# EAGLE design OPTO (EAGLE 6.6.0)
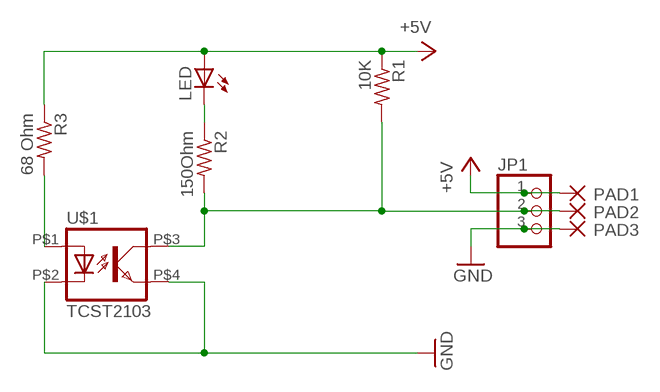
[diagram p0: schematic, sheet 1]

## Parts
JP1  PINHD-1X3CB  [1X03-CLEANBIG]
LED  LEDCHIPLED_0805  [CHIPLED_0805]
PAD1  WIREPADSMD1,27-254  [SMD1,27-2,54]
PAD2  WIREPADSMD1,27-254  [SMD1,27-2,54]
PAD3  WIREPADSMD1,27-254  [SMD1,27-2,54]
R1  10K  R-US_R0805  [R0805]
R2  150Ohm  R-US_R0805  [R0805]
R3  68 Ohm  R-US_R0805  [R0805]
U$1  TCST2103  [TCST2103]

## Nets
+5V: JP1.1 LED.A PAD1.1(P) R1.1 R3.1
GND: JP1.3 PAD3.1(P) U$1.P$2(C) U$1.P$4(EMIT)
N$1: LED.C R2.1
N$2: R3.2 U$1.P$1(A)
N$3: JP1.2 PAD2.1(P) R1.2 R2.2 U$1.P$3(COL)

## Library data of the parts
JP1 = adafruit:PINHD-1X3: PIN HEADER
LED = adafruit:LED: LED OSRAM: - CHIPLED LG R971, LG N971, LY N971, LG Q971, LY Q971, LO R971, LY R971 LH N974, LH R974 LS Q976, LO Q976, LY Q976 LO Q996 - Hyper CHIPLED LW Q18S LB Q993, LB Q99A, LB R99A - SideLED LS A670, LO A670, LY A670, LG A670, LP A670 LB A673, LV A673, LT A673, LW A673 LH A674 LY A675 LS A676, LA A676, LO A676, LY A676, LW A676 LS A679, LY A679, LG A679 - Hyper Micro SIDELED® LS Y876, LA Y876, LO Y876, LY Y876 LT Y87S - SmartLED LW L88C, LW L88S LB L89C, LB L89S, LG L890 LS L89K, LO L89K, LY L89K LS L896, LA L896, LO L896, LY L896 - TOPLED LS T670, LO T670, LY T670, LG T670, LP T670 LSG T670, LSP T670, LSY T670, LOP T670, LYG T670 LG T671, LOG T671, LSG T671 LB T673, LV T673, LT T673, LW T673 LH T674 LS T676, LA T676, LO T676, LY T676, LB T676, LH T676, LSB T676, LW T676 LB T67C, LV T67C, LT T67C, LS T67K, LO T67K, LY T67K, LW E67C LS E67B, LA E67B, LO E67B, LY E67B, LB E67C, LV E67C, LT E67C LW T67C LS T679, LY T679, LG T679 LS T770, LO T770, LY T770, LG T770, LP T770 LB T773, LV T773, LT T773, LW T773 LH T774 LS E675, LA E675, LY E675, LS T675 LS T776, LA T776, LO T776, LY T776, LB T776 LHGB T686 LT T68C, LB T68C - Hyper Mini TOPLED® LB M676 - Mini TOPLED Santana® LG M470 LS M47K, LO M47K, LY M47K Source: http://www.osram.convergy.de/
PAD1-PAD3 = wirepad:WIREPAD: Wire PAD connect wire on PCB
R1-R3 = adafruit:R-US_: RESISTOR, American symbol
U$1 = optocoupler:TCST2103

## Board
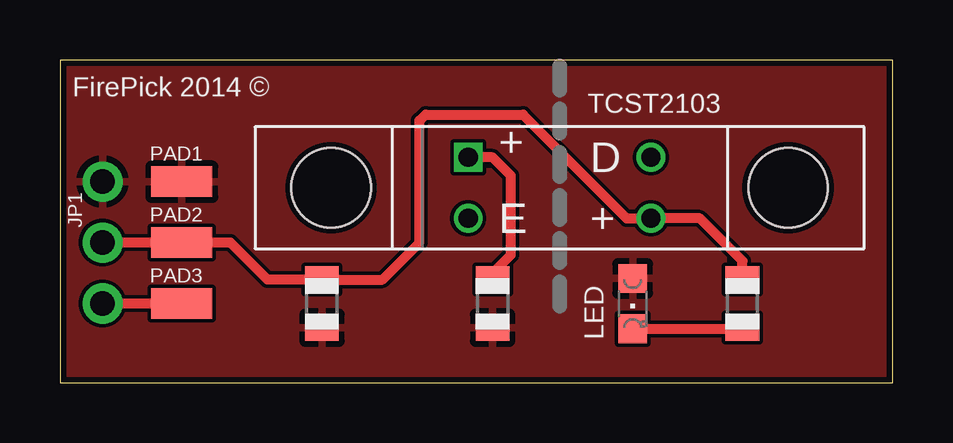
[diagram p1: board, top side]
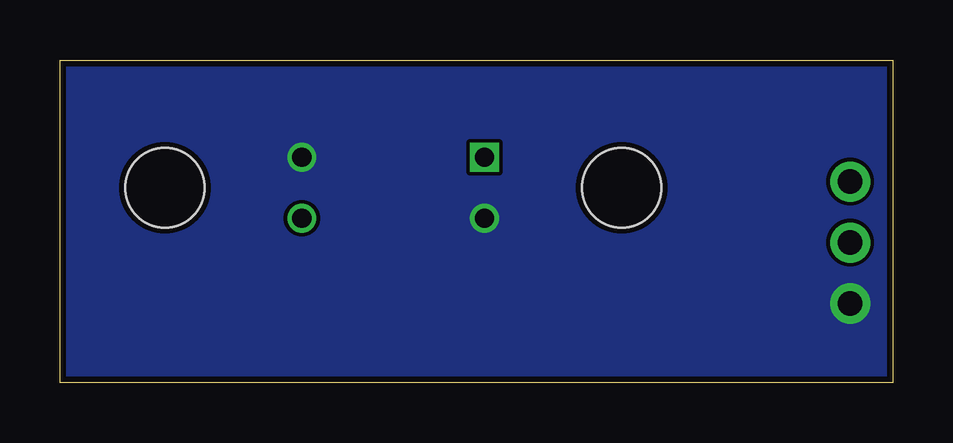
[diagram p2: board, bottom side, seen from below]

Size 34.72 x 13.45 mm. Coordinates in mm from the lower left corner, seen from the top.
Outline: 0,0 34.72,0 34.72,13.45 0,13.45 0,0
Copper layers (1*2*15*16): Top 0.035mm / dielectric 0.2mm / layer 2 0.0175mm / dielectric 1.1mm / layer 15 0.0175mm / dielectric 0.2mm / Bottom 0.035mm
Design rules "SeeedStudio_DRU_no_angle_20130527": minimum track width 6mil, minimum drill 12mil, track to track 6mil, track to pad 6mil, pad to pad 6mil, via to via 6mil, smd to smd 0mil, copper to edge 10mil, drill to drill 10mil, minimum pad ring 6mil, minimum via ring 6mil, stop-mask expansion 2mil, vias tented up to drill 25mil, thermal gap 10mil

### Footprints (pad centres in the part's own frame; a part is rotated, then mirrored left to right if it is on the bottom)
1X03-CLEANBIG = drill 1.016 pad 1.676: 1 -2.54,0; 2 0,0; 3 2.54,0
CHIPLED_0805 = smd 1.2 x 1.2: A 0,-1.05; C 0,1.05
SMD1,27-2,54 = smd 1.27 x 2.54: 1 0,0
R0805 = smd 1.1 x 1.4: 1 -1,0; 2 1,0
TCST2103 = drill 0.8 square: P$1 -3.81,1.27 | drill 0.8: P$2 -3.81,-1.27; P$3 3.81,-1.27; P$4 3.81,1.27 | hole 3.3: -9.525,0; 9.525,0

### Placement (x,y rotation side)
JP1  1.78,5.84 270 top
LED  23.88,3.3 180 top
PAD1  5.08,8.38 90 top
PAD2  5.08,5.84 90 top
PAD3  5.08,3.3 90 top
R1  10.92,3.3 90 top
R2  28.45,3.3 90 top
R3  18.03,3.3 90 top
U$1  20.83,8.13 0 top

### Tracks (layer width: path | path; a pad name or v marks a point on that pad's centre or on a via)
+5V
  pour Top: 34.8,13.46 0,13.46 0,0 34.8,0
GND
  Top 0.406: PAD3.1 JP1.3
  pour Bottom (no thermals): 0,13.46 34.8,13.46 34.8,0 0,0
N$1
  Top 0.406: LED.C 28.4,2.25 R2.1
N$2
  Top 0.406: R3.2 18.03,4.57 18.8,5.33 18.8,8.64 18.03,9.4 U$1.P$1
N$3
  Top 0.406: JP1.2 PAD2.1 7.11,5.84 8.65,4.3 R1.2 13.45,4.3 14.99,5.84 14.99,10.92 15.24,11.18 19.3,11.18 23.62,6.86 U$1.P$3 26.67,6.86 28.45,5.08 R2.2

### Text on the board
tNames: FirePick 2014 ©